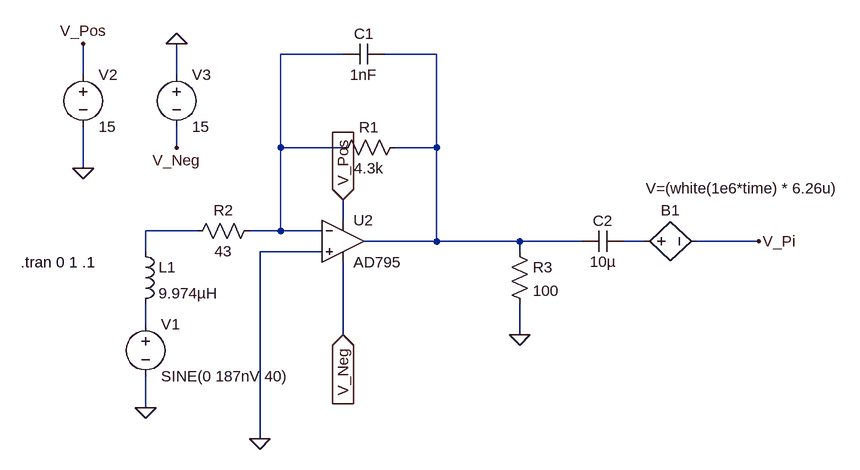
[diagram p0: schematic Magnetometer_Single_String_Lorenzo_Revisons.asc]
Magnetometer_Single_String_Lorenzo_Revisons.asc, the LTspice schematic file:
Version 4.1
SHEET 1 1788 680
WIRE 336 0 240 0
WIRE 480 0 400 0
WIRE -64 32 -64 -16
WIRE 80 32 80 -16
WIRE 80 144 80 112
WIRE 240 144 240 0
WIRE 336 144 240 144
WIRE 480 144 480 0
WIRE 480 144 416 144
WIRE -64 176 -64 112
WIRE 336 256 336 224
WIRE 112 272 32 272
WIRE 240 272 240 144
WIRE 240 272 192 272
WIRE 304 272 240 272
WIRE 480 288 480 144
WIRE 480 288 368 288
WIRE 608 288 480 288
WIRE 704 288 608 288
WIRE 800 288 768 288
WIRE 976 288 880 288
WIRE 32 304 32 272
WIRE 304 304 208 304
WIRE 608 304 608 288
WIRE 32 416 32 384
WIRE 336 432 336 320
WIRE 608 432 608 384
WIRE 32 544 32 496
WIRE 208 592 208 304
FLAG 608 432 0
FLAG 208 592 0
FLAG 336 224 V_Pos
IOPIN 336 224 In
FLAG 336 432 V_Neg
IOPIN 336 432 In
FLAG -64 -16 V_Pos
FLAG -64 176 0
FLAG 80 -16 0
FLAG 80 144 V_Neg
FLAG 976 288 V_Pi
FLAG 32 544 0
SYMBOL Res 432 128 R90
WINDOW 0 0 56 VBottom 2
WINDOW 3 32 56 VTop 2
SYMATTR InstName R1
SYMATTR Value 4.3k
SYMBOL Res 208 256 R90
WINDOW 0 0 56 VBottom 2
WINDOW 3 32 56 VTop 2
SYMATTR InstName R2
SYMATTR Value 43
SYMBOL Res 592 288 R0
SYMATTR InstName R3
SYMATTR Value 100
SYMBOL OpAmps/AD795 336 224 R0
SYMATTR InstName U2
SYMBOL Voltage -64 16 R0
SYMATTR InstName V2
SYMATTR Value 15
SYMBOL Voltage 80 16 R0
SYMATTR InstName V3
SYMATTR Value 15
SYMBOL bv 784 288 R270
WINDOW 0 32 56 VTop 2
WINDOW 3 97 167 VBottom 2
SYMATTR InstName B1
SYMATTR Value V=(white(1e6*time) * 6.26u)
SYMBOL Cap 768 272 R90
WINDOW 0 0 32 VBottom 2
WINDOW 3 32 32 VTop 2
SYMATTR InstName C2
SYMATTR Value 10µ
SYMBOL ind 16 288 R0
SYMATTR InstName L1
SYMATTR Value 9.974µH
SYMBOL voltage 32 400 R0
WINDOW 123 0 0 Left 0
WINDOW 39 0 0 Left 0
SYMATTR InstName V1
SYMATTR Value SINE(0 187nV 40)
SYMBOL cap 400 -16 R90
WINDOW 0 0 32 VBottom 2
WINDOW 3 32 32 VTop 2
SYMATTR InstName C1
SYMATTR Value 1nF
TEXT -160 320 Left 2 !.tran 0 1 .1

The netlist it stands for:
* Magnetometer_Single_String_Lorenzo_Revisons.asc
R1 N002 N001 4.3k
R2 N001 N003 43
R3 N002 0 100
X§U2 0 N001 V_Pos V_Neg N002 AD795  ; pins In+ In- V+ V- OUT
V2 V_Pos 0 15
V3 0 V_Neg 15
B1 N004 V_Pi V=(white(1e6*time) * 6.26u)
C2 N004 N002 10µ
L1 N003 N005 9.974µH
V1 N005 0 SINE(0 187nV 40)
C1 N002 N001 1nF
.tran 0 1 .1
.lib ADI1.lib
.backanno
.end